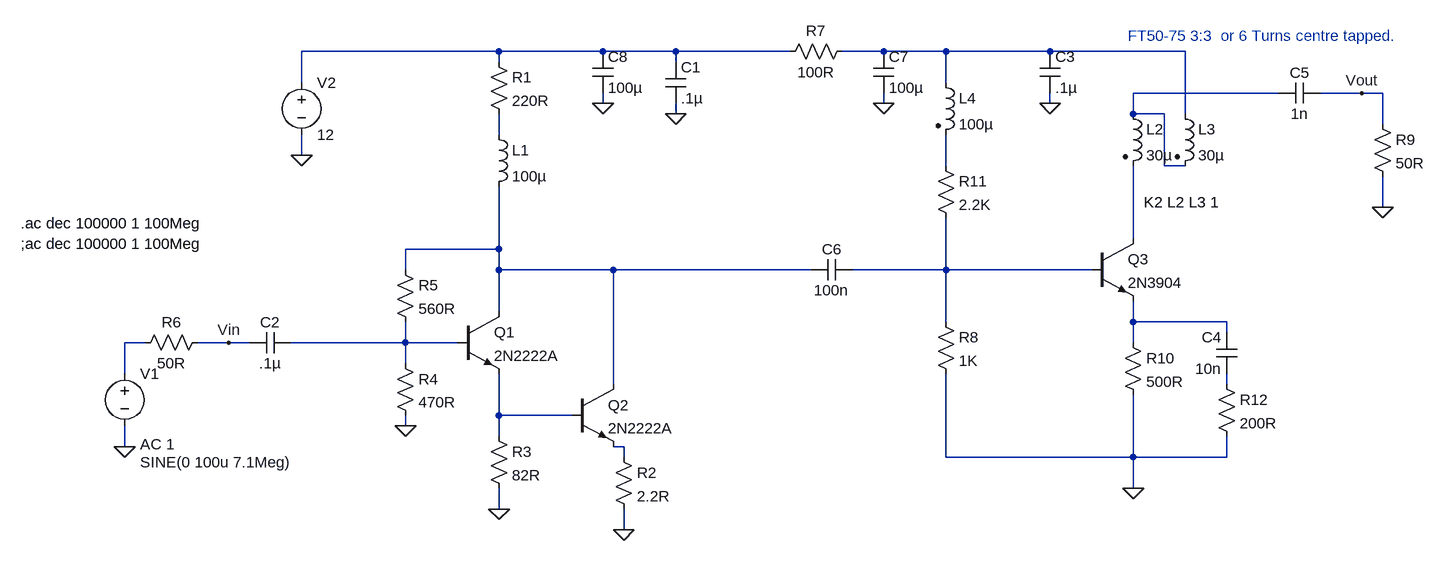
[diagram p0: schematic RF Pre Amp With Gain Test.asc]
RF Pre Amp With Gain Test.asc, the LTspice schematic file:
Version 4
SHEET 1 1976 852
WIRE 336 -256 32 -256
WIRE 496 -256 336 -256
WIRE 608 -256 496 -256
WIRE 784 -256 608 -256
WIRE 928 -256 864 -256
WIRE 1024 -256 928 -256
WIRE 1184 -256 1024 -256
WIRE 1392 -256 1184 -256
WIRE 336 -240 336 -256
WIRE 608 -240 608 -256
WIRE 32 -208 32 -256
WIRE 1024 -208 1024 -256
WIRE 1536 -192 1312 -192
WIRE 1664 -192 1600 -192
WIRE 1696 -192 1664 -192
WIRE 496 -176 496 -192
WIRE 928 -176 928 -192
WIRE 1184 -176 1184 -192
WIRE 608 -160 608 -176
WIRE 1312 -160 1312 -192
WIRE 1360 -160 1312 -160
WIRE 1392 -160 1392 -256
WIRE 1696 -144 1696 -192
WIRE 336 -128 336 -160
WIRE 32 -96 32 -128
WIRE 1024 -80 1024 -128
WIRE 1360 -80 1360 -160
WIRE 1392 -80 1360 -80
WIRE 1696 -16 1696 -64
WIRE 1312 32 1312 -80
WIRE 336 48 336 -48
WIRE 336 48 192 48
WIRE 192 80 192 48
WIRE 336 80 336 48
WIRE 512 80 336 80
WIRE 816 80 512 80
WIRE 1024 80 1024 0
WIRE 1024 80 880 80
WIRE 1248 80 1024 80
WIRE 336 144 336 80
WIRE 1024 160 1024 80
WIRE 1312 160 1312 128
WIRE 1456 160 1312 160
WIRE 1456 176 1456 160
WIRE -208 192 -240 192
WIRE -80 192 -128 192
WIRE -48 192 -80 192
WIRE 192 192 192 160
WIRE 192 192 16 192
WIRE 272 192 192 192
WIRE 1312 192 1312 160
WIRE 192 224 192 192
WIRE -240 240 -240 192
WIRE 512 256 512 80
WIRE 1456 256 1456 240
WIRE 336 304 336 240
WIRE 448 304 336 304
WIRE 192 320 192 304
WIRE 336 336 336 304
WIRE -240 352 -240 320
WIRE 528 352 512 352
WIRE 528 368 528 352
WIRE 1024 368 1024 240
WIRE 1312 368 1312 272
WIRE 1312 368 1024 368
WIRE 1456 368 1456 336
WIRE 1456 368 1312 368
WIRE 1312 416 1312 368
WIRE 336 448 336 416
WIRE 528 480 528 448
FLAG 32 -96 0
FLAG -240 352 0
FLAG 336 448 0
FLAG 528 480 0
FLAG 608 -160 0
FLAG 192 320 0
FLAG -80 192 Vin
FLAG 1312 416 0
FLAG 1696 -16 0
FLAG 1664 -192 Vout
FLAG 928 -176 0
FLAG 1184 -176 0
FLAG 496 -176 0
SYMBOL voltage -240 224 R0
WINDOW 3 24 152 Left 2
WINDOW 123 24 124 Left 2
WINDOW 39 0 0 Left 2
SYMATTR InstName V1
SYMATTR Value SINE(0 100u 7.1Meg)
SYMATTR Value2 AC 1
SYMBOL voltage 32 -224 R0
WINDOW 123 0 0 Left 2
WINDOW 39 0 0 Left 2
SYMATTR InstName V2
SYMATTR Value 12
SYMBOL npn 272 144 R0
SYMATTR InstName Q1
SYMATTR Value 2N2222A
SYMBOL npn 448 256 R0
SYMATTR InstName Q2
SYMATTR Value 2N2222A
SYMBOL ind 320 -144 R0
SYMATTR InstName L1
SYMATTR Value 100µ
SYMBOL res 320 -256 R0
SYMATTR InstName R1
SYMATTR Value 220R
SYMBOL cap 592 -240 R0
SYMATTR InstName C1
SYMATTR Value .1µ
SYMBOL res 512 352 R0
SYMATTR InstName R2
SYMATTR Value 2.2R
SYMBOL res 320 320 R0
SYMATTR InstName R3
SYMATTR Value 82R
SYMBOL res 176 208 R0
SYMATTR InstName R4
SYMATTR Value 470R
SYMBOL res 176 64 R0
SYMATTR InstName R5
SYMATTR Value 560R
SYMBOL res -112 176 R90
WINDOW 0 0 56 VBottom 2
WINDOW 3 32 56 VTop 2
SYMATTR InstName R6
SYMATTR Value 50R
SYMBOL cap 16 176 R90
WINDOW 0 0 32 VBottom 2
WINDOW 3 32 32 VTop 2
SYMATTR InstName C2
SYMATTR Value .1µ
SYMBOL npn 1248 32 R0
SYMATTR InstName Q3
SYMATTR Value 2N3904
SYMBOL res 1008 144 R0
SYMATTR InstName R8
SYMATTR Value 1K
SYMBOL cap 1472 240 R180
WINDOW 0 24 56 Left 2
WINDOW 3 24 8 Left 2
SYMATTR InstName C4
SYMATTR Value 10n
SYMBOL cap 1600 -208 R90
WINDOW 0 0 32 VBottom 2
WINDOW 3 32 32 VTop 2
SYMATTR InstName C5
SYMATTR Value 1n
SYMBOL ind2 1296 -176 R0
SYMATTR InstName L2
SYMATTR Value 30µ
SYMATTR Type ind
SYMBOL ind2 1376 -176 R0
SYMATTR InstName L3
SYMATTR Value 30µ
SYMATTR Type ind
SYMBOL res 1680 -160 R0
SYMATTR InstName R9
SYMATTR Value 50R
SYMBOL res 1296 176 R0
SYMATTR InstName R10
SYMATTR Value 500R
SYMBOL res 1008 -96 R0
SYMATTR InstName R11
SYMATTR Value 2.2K
SYMBOL ind2 1008 -224 R0
SYMATTR InstName L4
SYMATTR Value 100µ
SYMATTR Type ind
SYMBOL res 1440 240 R0
SYMATTR InstName R12
SYMATTR Value 200R
SYMBOL cap 880 64 R90
WINDOW 0 0 32 VBottom 2
WINDOW 3 32 32 VTop 2
SYMATTR InstName C6
SYMATTR Value 100n
SYMBOL cap 1168 -256 R0
SYMATTR InstName C3
SYMATTR Value .1µ
SYMBOL cap 912 -256 R0
SYMATTR InstName C7
SYMATTR Value 100µ
SYMBOL res 880 -272 R90
WINDOW 0 0 56 VBottom 2
WINDOW 3 32 56 VTop 2
SYMATTR InstName R7
SYMATTR Value 100R
SYMBOL cap 480 -256 R0
SYMATTR InstName C8
SYMATTR Value 100µ
TEXT -400 40 Left 2 !;ac dec 100000 1 100Meg
TEXT -400 8 Left 2 !.ac dec 100000 1 100Meg
TEXT 1328 -24 Left 2 !K2 L2 L3 1
TEXT 1304 -280 Left 2 ;FT50-75 3:3  or 6 Turns centre tapped.

The netlist it stands for:
* RF Pre Amp With Gain Test.asc
V1 N010 0 SINE(0 100u 7.1Meg) AC 1
V2 N001 0 12
Q1 N007 N011 N013 0 2N2222A
Q2 N007 N013 N014 0 2N2222A
L1 N004 N007 100µ
R1 N001 N004 220R
C1 N001 0 .1µ
R2 N014 0 2.2R
R3 N013 0 82R
R4 N011 0 470R
R5 N007 N011 560R
R6 Vin N010 50R
C2 N011 Vin .1µ
Q3 N006 N008 N009 0 2N3904
R8 N008 0 1K
C4 N012 N009 10n
C5 Vout N003 1n
L2 N003 N006 30µ
L3 N002 N003 30µ
R9 Vout 0 50R
R10 N009 0 500R
R11 N005 N008 2.2K
L4 N002 N005 100µ
R12 N012 0 200R
C6 N008 N007 100n
C3 N002 0 .1µ
C7 N002 0 100µ
R7 N002 N001 100R
C8 N001 0 100µ
.model NPN NPN
.model PNP PNP
.lib standard.bjt
;ac dec 100000 1 100Meg
.ac dec 100000 1 100Meg
K2 L2 L3 1
* FT50-75 3:3  or 6 Turns centre tapped.
.backanno
.end